# Altium schematic sheet Doorlock-ESP32-copy_2026-03-03.schdoc
size 296 x 182 mm
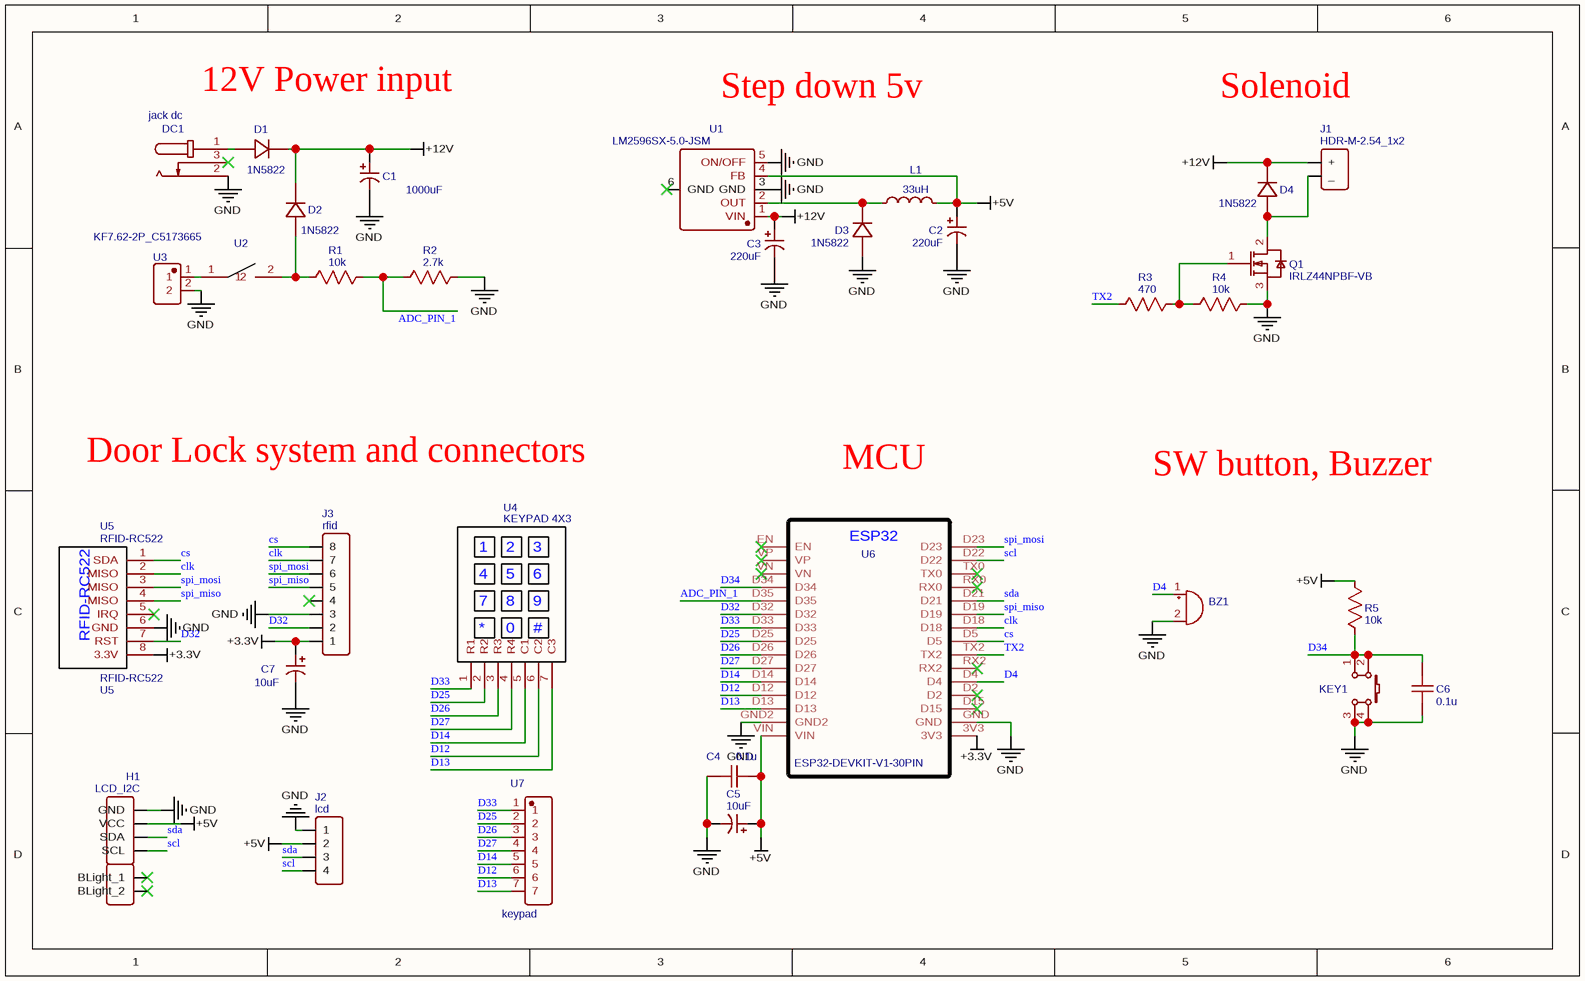
[diagram p0: Doorlock-ESP32-copy_2026-03-03.schdoc]

## Parts
BZ1  DEVICE_BUZZER  [BUZZER_BEEPER:BUZZER_12X9.5RM7.6]  (value not drawn)
C1  1000uF  [CAP-TH_BD10.0-P5.00-D1.0-FD]
C2  220uF  [CAP-TH_BD10.0-P5.00-D1.0-FD]
C3  220uF  [CAP-TH_BD10.0-P5.00-D1.0-FD]
C4  0.1u  [RAD-0.1]
C5  10uF  [CAP-TH_BD5.0-P2.00-D0.8-FD-10UF50VC110GL]
C6  0.1u  [RAD-0.1]
C7  10uF  [CAP-TH_BD5.0-P2.00-D0.8-FD-10UF50VC110GL]
D1  1N5822  [DO-41_BD2.4-L4.7-P8.70-D0.9-RD]
D2  1N5822  [DO-41_BD2.4-L4.7-P8.70-D0.9-RD]
D3  1N5822  [DO-41_BD2.4-L4.7-P8.70-D0.9-RD]
D4  1N5822  [DO-41_BD2.4-L4.7-P8.70-D0.9-RD]
DC1  jack dc  [DC-IN-TH_DC005]
H1  LCD_I2C  [LCD-TH_LCD-1602-2X16-I2C-V2]
J1  HDR-M-2.54_1x2  [HDR-M-2.54_1X2]
J2  lcd  [HDR-M-2.54_1X4]
J3  rfid  [HDR-M-2.54_1X8]
KEY1  K4-12×12_TH  [KEY-TH_4P-L12.0-W12.0-P5.00-LS12.5]  (value not drawn)
L1  33uH  [L_AXIAL-0.4]
Q1  IRLZ44NPBF-VB  [TO-220-3_L10.0-W4.5-P2.54-L-2]
R1  10k  [R_AXIAL-0.3]
R2  2.7k  [R_AXIAL-0.3]
R3  470  [R_AXIAL-0.3]
R4  10k  [R_AXIAL-0.3]
R5  10k  [R_AXIAL-0.3]
U1  LM2596SX-5.0-JSM  [TO-263-5_L10.0-W8.4-P1.70-LS15.3-BR]
U2  HX KCD1-2P-P  [SW-TH_L22.2-W15.0-P7.00_KCD1-2P-P]  (value not drawn)
U3  KF7.62-2P_C5173665  [CONN-TH_2P-P7.62_KEFA_KF7.62-2P]
U4  KEYPAD 4X3  [KEYPAD3X4]
U5  RFID-RC522  [RFID-RC522A]
U6  ESP32-DEVKIT-V1-30PIN  [ESP32-DEVKITV1_ESP32-DEVKITV1]
U7  keypad  [CONN-TH_PZ2.54-1X7P-ZW]

## Nets
+3.3V: C7.1 J3.1 U5.8(3.3V) U6.3V3
+5V: C2.1 C4.1 C5.1 H1.2(VCC) J2.2 L1.2 R5.1 U1.4(FB) U6.VIN
+12V: C1.1 C3.1 D1.1(K) D2.1(K) D4.1(K) J1.1(+) U1.1(VIN)
GND: BZ1.2(-) C1.2 C2.2 C3.2 C4.2 C5.2 C6.1 C7.2 D3.2(A) DC1.2 H1.1(GND) J2.1 J3.3 KEY1.3 KEY1.4 Q1.3(S) R2.2 R4.2 U1.3(GND) U1.5(ON/OFF) U3.2 U5.6(GND) U6.GND U6.GND2
ADC_PIN_1: R1.2 R2.1 U6.D35
clk: J3.7 U5.2(MISO) U6.D18
cs: J3.8 U5.1(SDA) U6.D5
D4: BZ1.1(+) U6.D4
D12: U4.6(C2) U6.D12 U7.6
D13: U4.7(C3) U6.D13 U7.7
D14: U4.5(C1) U6.D14 U7.5
D25: U4.2(R2) U6.D25 U7.2
D26: U4.3(R3) U6.D26 U7.3
D27: U4.4(R4) U6.D27 U7.4
D32: J3.2 U5.7(RST) U6.D32
D33: U4.1(R1) U6.D33 U7.1
D34: C6.2 KEY1.1 KEY1.2 R5.2 U6.D34
scl: H1.4(SCL) J2.4 U6.D22
sda: H1.3(SDA) J2.3 U6.D21
spi_miso: J3.5 U5.4(MISO) U6.D19
spi_mosi: J3.6 U5.3(MISO) U6.D23
TX2: R3.1 U6.TX2
NetD1_2: D1.2(A) DC1.1
NetD2_2: D2.2(A) R1.1 U2.2
NetD3_1: D3.1(K) L1.1 U1.2(OUT)
NetD4_2: D4.2(A) J1.2(_) Q1.2(D)
NetQ1_1: Q1.1(G) R3.2 R4.1
NetU2_1: U2.1 U3.1

Not connected (* = marked no-connect by the designer): DC1 3*; H1 5(BLight_1)* 6(BLight_2)*; J3 4*; U1 6(GND)*; U5 5(IRQ)*; U6 D2* D15* EN* RX0* RX2* TX0* VN* VP*

## Notes on the sheet
- 12V Power input
- Step down 5v
- Solenoid
- Door Lock system and connectors
- MCU
- SW button, Buzzer
- (in symbol ESP32-DEVKIT-V1-30PIN) ESP32
- (in symbol KEYPAD 4X3) 8; 9; 0; #

## Library data of the parts
BZ1 = DEVICE_BUZZER: Add into BOM: yes; Contributor: anhnguyen0904255; Symbol: Device_Buzzer; Device: Device_Buzzer; User doc link: ~; Convert to PCB: yes; Origin Footprint: Buzzer_Beeper:Buzzer_12x9.5RM7.6; spicePre: B; spiceSymbolName: Device_Buzzer
C1 = 1000uF: Manufacturer: HRK(鸿瑞凯电子); Manufacturer Part: 25V1000uF CD110; nameAlias: Value; Contributor: lcsc; Supplier: LCSC; Supplier Part: C2960400; JLCPCB Part Class: Extended Part; spicePre: C; spiceSymbolName: 25V1000UF CD110
C2 C3 = 220uF: Manufacturer: HRK(鸿瑞凯电子); Manufacturer Part: 25V1000uF CD110; nameAlias: Value; Contributor: lcsc; Supplier: LCSC; Supplier Part: C2960400; JLCPCB Part Class: Extended Part; spicePre: C; spiceSymbolName: 25V1000UF CD110
C4 C6 = 0.1u: nameAlias: Value(F); Contributor: LCEDA_Lib; spicePre: C; spiceSymbolName: C_RAD-0.1_US
C5 C7 = 10uF: Manufacturer: Econd(米朗电子); Manufacturer Part: 10UF50VC110GL; nameAlias: Value; Contributor: lcsc; Supplier: LCSC; Supplier Part: C46867109; spicePre: C; spiceSymbolName: 10UF50VC110GL
D1-D4 = 1N5822: Manufacturer: YFW(佑风微); Manufacturer Part: 1N5819散装0658; Contributor: lcsc; Supplier: LCSC; Supplier Part: C2906380; JLCPCB Part Class: Extended Part; spicePre: D; spiceSymbolName: 1N5819散装0658
DC1 = jack dc: Manufacturer: SOFNG; Manufacturer Part: DC005-2.0MM; Supplier: LCSC; Supplier Part: C111567; spicePre: D; spiceSymbolName: DC005-2.0MM
H1 = LCD_I2C: subpart_no: 1; Contributor: amadosumbi3; spicePre: H; spiceSymbolName: LCD_I2C
J1 = HDR-M-2.54_1x2: Contributor: LCEDA_Lib; Supplier Part: C124375; Supplier: LCSC; spicePre: J; spiceSymbolName: HDR-M-2.54_1x2
J2 = lcd: Contributor: LCEDA_Lib; Supplier Part: C124378; Supplier: LCSC; spicePre: J; spiceSymbolName: HDR-M-2.54_1x4
J3 = rfid: Contributor: LCEDA_Lib; Supplier Part: C190820; Supplier: LCSC; spicePre: J; spiceSymbolName: HDR-M-2.54_1x8
KEY1 = K4-12×12_TH: Manufacturer: 韩国韩荣; Manufacturer Part: K2-1103DP-M4SW-04; Contributor: LCEDA_Lib; Supplier Part: C128053; Supplier: LCSC; spicePre: K; spiceSymbolName: K4-12×12_TH
L1 = 33uH: nameAlias: Value(H); Contributor: LCEDA_Lib; spicePre: L; spiceSymbolName: L_AXIAL-0.4_US
Q1 = IRLZ44NPBF-VB: Manufacturer: VBsemi(微碧半导体); Contributor: lcsc; Supplier: LCSC; Supplier Part: C20755022; Manufacturer Part: IRLZ44NPBF-VB; JLCPCB Part Class: Extended Part; spicePre: Q; spiceSymbolName: IRLZ44NPBF-VB
R1 R4 R5 = 10k: nameAlias: Value(Ω); Contributor: LCEDA_Lib; spicePre: R; spiceSymbolName: R_AXIAL-0.3_US
R2 = 2.7k: nameAlias: Value(Ω); Contributor: LCEDA_Lib; spicePre: R; spiceSymbolName: R_AXIAL-0.3_US
R3 = 470: nameAlias: Value(Ω); Contributor: LCEDA_Lib; spicePre: R; spiceSymbolName: R_AXIAL-0.3_US
U1 = LM2596SX-5.0-JSM: Manufacturer: JSMSEMI(杰盛微); Contributor: lcsc; Supplier: LCSC; Supplier Part: C22470412; Manufacturer Part: LM2596SX-5.0-JSM; JLCPCB Part Class: Extended Part; spicePre: U; spiceSymbolName: LM2596SX-5.0-JSM
U2 = HX KCD1-2P-P: Manufacturer: hanxia(韩下); Contributor: lcsc; Supplier: LCSC; Supplier Part: C6917321; Manufacturer Part: HX KCD1-2P-P; JLCPCB Part Class: Extended Part; spicePre: U; spiceSymbolName: HX KCD1-2P-P
U3 = KF7.62-2P_C5173665: Manufacturer: KEFA(科发); Manufacturer Part: KF7.62-2P(green); Contributor: lcsc; Supplier: LCSC; Supplier Part: C5173665; JLCPCB Part Class: Extended Part; spicePre: U; spiceSymbolName: KF7.62-2P_C5173665
U4 = KEYPAD 4X3: Contributor: lucas.vissers; spicePre: U; spiceSymbolName: KEYPAD 4X3
U5 = RFID-RC522: Contributor: mayurharge; spicePre: U; spiceSymbolName: RFID-RC522
U6 = ESP32-DEVKIT-V1-30PIN: Contributor: juergs; spicePre: ?; spiceSymbolName: ESP32-DEVKIT-V1-30PIN
U7 = keypad: Manufacturer: null; Manufacturer Part: PZ2.54-1X7P-ZW; Contributor: LCSC; JLCPCB Part Class: Extended Part; Supplier: LCSC; Supplier Part: C2838018; spicePre: U; spiceSymbolName: PZ2.54-1X7P-ZW